# Altium project AudioTest.PrjPcb
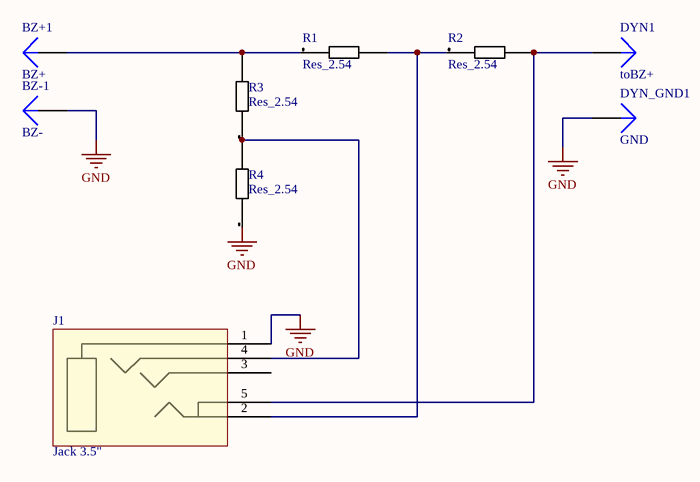
[diagram p0: Sheet1.SchDoc]
1 sheet, 9 parts. Net scope: global (net labels, ports and power ports of the same name join across sheets).
Board files: PCB3.PcbDoc, PCB2.PcbDoc, PCB1.PcbDoc

## Sheet Sheet1.SchDoc
size A4

### Parts
BZ+1  BZ+  [Solder PAD 4*4]
BZ-1  BZ-  [Solder PAD 4*4]
DYN1  toBZ+  [Solder PAD 4*4]
DYN_GND1  GND  [Solder PAD 4*4]
J1  Jack 3.5"  [micro SJ-43515TS-SMT - duplicate - duplicate]
R1  Res_2.54  [1608[0603]-Xs1.0Ys1.1A0.76RR_RES]
R2  Res_2.54  [1608[0603]-Xs1.0Ys1.1A0.76RR_RES]
R3  Res_2.54  [1608[0603]-Xs1.0Ys1.1A0.76RR_RES]
R4  Res_2.54  [1608[0603]-Xs1.0Ys1.1A0.76RR_RES]

### Nets
GND: BZ-1.1 DYN_GND1.1 J1.1 R4.1
NetBZ+1_1: BZ+1.1 R1.1 R3.2
NetDYN1_1: DYN1.1 J1.5 R2.2
NetJ1_2: J1.2 R1.2 R2.1
NetJ1_4: J1.4 R3.1 R4.2

Not connected (* = marked no-connect by the designer): J1 3

### Library data of the parts
BZ+1 BZ-1 DYN1 DYN_GND1 = Plug: LatestRevisionDate: 17-Jul-2002; LatestRevisionNote: Re-released for DXP Platform.; Publisher: Altium Limited
J1 = PhoneJack 4contact: miniJack 4 contact
R1-R4 = Res_2.54: Resistor; Value: *